# Altium schematic sheet SPECIAL_INPUT.SchDoc
size A4; SheetNumber: 9; SheetTotal: 15
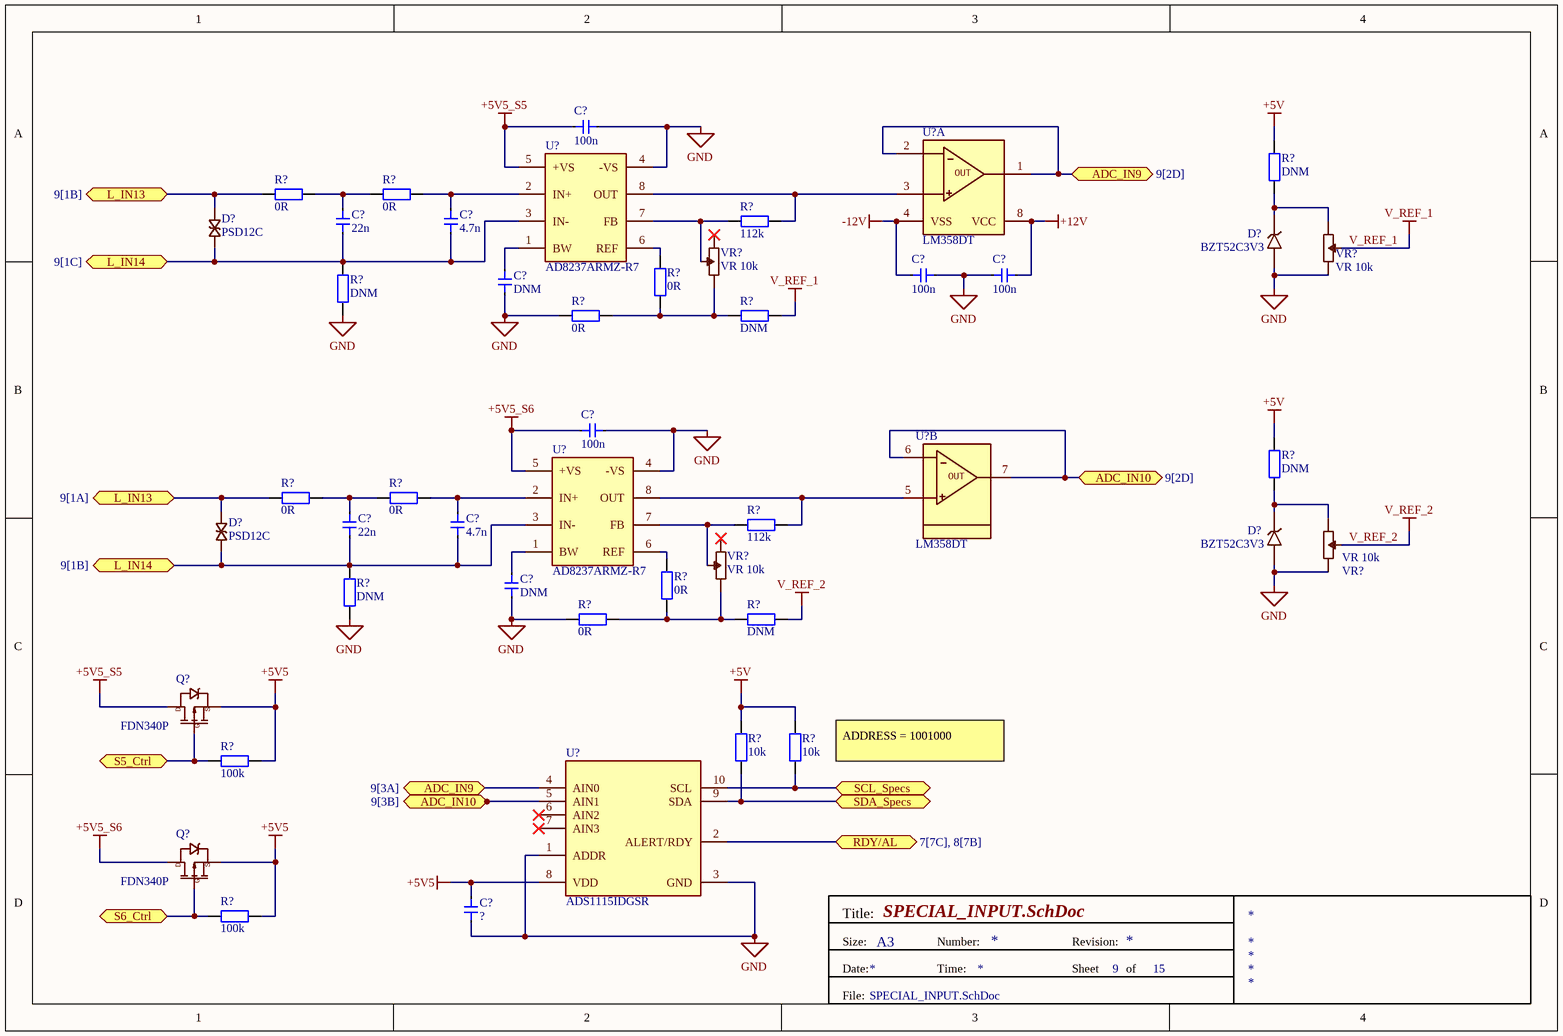
[diagram p0: SPECIAL_INPUT.SchDoc]

## Parts
(Parts that share a designator on the sheet are numbered #1, #2 ... from top to bottom, then left to right.)
C?#1  100n  [Cap 0603]
C?#2  22n  [Cap 0603]
C?#3  4.7n  [Cap 0603]
C?#4  100n  [Cap 0603]
C?#5  100n  [Cap 0603]
C?#6  DNM  [Cap 0603]
C?#7  100n  [Cap 0603]
C?#8  22n  [Cap 0603]
C?#9  4.7n  [Cap 0603]
C?#10  DNM  [Cap 0603]
C?#11  ?  [Cap 0603]
D?#1  PSD12C  [SOD-323]
D?#2  BZT52C3V3  [SOD-123F]
D?#3  PSD12C  [SOD-323]
D?#4  BZT52C3V3  [SOD-123F]
Q?#1  FDN340P  [FDN340P]
Q?#2  FDN340P  [FDN340P]
R?#1  DNM  [tro smd 0603]
R?#2  0R  [tro smd 0603]
R?#3  0R  [tro smd 0603]
R?#4  112k  [Tro smd 0603]
R?#5  0R  [tro smd 0603]
R?#6  DNM  [tro smd 0603]
R?#7  0R  [tro smd 0603]
R?#8  DNM  [tro smd 0603]
R?#9  DNM  [tro smd 0603]
R?#10  0R  [tro smd 0603]
R?#11  0R  [tro smd 0603]
R?#12  112k  [Tro smd 0603]
R?#13  0R  [tro smd 0603]
R?#14  DNM  [tro smd 0603]
R?#15  0R  [tro smd 0603]
R?#16  DNM  [tro smd 0603]
R?#17  10k  [tro smd 0603]
R?#18  10k  [tro smd 0603]
R?#19  100k  [tro smd 0603]
R?#20  100k  [tro smd 0603]
U?#1  LM358DT  [SOIC8]  (part A of 2)
U?#2  AD8237ARMZ-R7  [AD8237ARMZ-R7]
U?#3  LM358DT  [SOIC8]  (part B of 2)
U?#4  AD8237ARMZ-R7  [AD8237ARMZ-R7]
U?#5  ADS1115IDGSR  [AD8237ARMZ-R7]
VR?#1  VR 10k  [VR]
VR?#2  VR 10k  [VR]
VR?#3  VR 10k  [VR]
VR?#4  VR 10k  [VR]

## Ports
ADC_IN9 (bidir, see 9[2D]), ADC_IN9 (bidir, see 9[3A]), ADC_IN10 (bidir, see 9[2D]), ADC_IN10 (bidir, see 9[3B]), L_IN13 (bidir, see 9[1A]), L_IN13 (bidir, see 9[1B]), L_IN14 (bidir, see 9[1B]), L_IN14 (bidir, see 9[1C]), RDY/AL (bidir, see 7[7C], 8[7B]), S5_Ctrl (bidir), S6_Ctrl (bidir), SCL_Specs (bidir), SDA_Specs (bidir)

## Nets
+5V: R?#1.2 R?#9.2 R?#17.2 R?#18.2
+5V5: C?#11.2 Q?#1.2 Q?#2.2 R?#19.2 R?#20.2 U?#5.8(VDD)
+5V5_S5: C?#1.1 Q?#1.3 U?#2.5(+VS)
+5V5_S6: C?#7.1 Q?#2.3 U?#4.5(+VS)
+12V: C?#5.2 U?#1.8(VCC)
-12V: C?#4.1 U?#1.4(VSS)
GND: C?#1.2 C?#4.2 C?#5.1 C?#6.2 C?#7.2 C?#10.2 C?#11.1 D?#2.A D?#4.A R?#6.2 R?#7.2 R?#14.2 R?#15.2 U?#2.4(-VS) U?#4.4(-VS) U?#5.1(ADDR) U?#5.3(GND) VR?#1.3 VR?#3.3
V_REF_1: R?#8.1 VR?#1.2
V_REF_2: R?#16.1 VR?#3.2
ADC_IN9: U?#1.1 U?#1.2 U?#5.4(AIN0) ; port ADC_IN9
ADC_IN10: U?#3.6 U?#3.7 U?#5.5(AIN1) ; port ADC_IN10
L_IN13: D?#1.C D?#3.C R?#2.1 R?#10.1 ; port L_IN13
L_IN14: C?#2.2 C?#3.2 C?#8.2 C?#9.2 D?#1.A D?#3.A R?#6.1 R?#14.1 U?#2.3(IN-) U?#4.3(IN-) ; port L_IN14
RDY/AL: U?#5.2(ALERT/RDY) ; port RDY/AL
S5_Ctrl: Q?#1.1 R?#19.1 ; port S5_Ctrl
S6_Ctrl: Q?#2.1 R?#20.1 ; port S6_Ctrl
SCL_Specs: R?#18.1 U?#5.10(SCL) ; port SCL_Specs
SDA_Specs: R?#17.1 U?#5.9(SDA) ; port SDA_Specs
NetC?#2_1: C?#2.1 R?#2.2 R?#3.1
NetC?#3_1: C?#3.1 R?#3.2 U?#2.2(IN+)
NetC?#6_1: C?#6.1 U?#2.1(BW)
NetC?#8_1: C?#8.1 R?#10.2 R?#11.1
NetC?#9_1: C?#9.1 R?#11.2 U?#4.2(IN+)
NetC?#10_1: C?#10.1 U?#4.1(BW)
NetD?#2_K: D?#2.K R?#1.1 VR?#1.1
NetD?#4_K: D?#4.K R?#9.1 VR?#3.1
NetR?#4_1: R?#4.1 U?#2.7(FB) VR?#2.2
NetR?#4_2: R?#4.2 U?#1.3 U?#2.8(OUT)
NetR?#5_1: R?#5.1 U?#2.6(REF)
NetR?#5_2: R?#5.2 R?#7.1 R?#8.2 VR?#2.1
NetR?#12_1: R?#12.1 U?#4.7(FB) VR?#4.2
NetR?#12_2: R?#12.2 U?#3.5 U?#4.8(OUT)
NetR?#13_1: R?#13.1 U?#4.6(REF)
NetR?#13_2: R?#13.2 R?#15.1 R?#16.2 VR?#4.1

Not connected (* = marked no-connect by the designer): U?#5 6(AIN2)* 7(AIN3)*; VR?#2 3*; VR?#4 3*

## Notes on the sheet
- (near R?#18) ADDRESS = 1001000
- Title:
- Size:
- Date:
- A3
- Number:
- Time:
- Revision:
- Sheet
- of
- File:
- (in symbol FDN340P) D; S; G
- (in symbol LM358DT, part A) OUT
- (in symbol LM358DT, part B) OUT

## Library data of the parts
C?#1-C?#11 = Cap 0603: Capacitor SMD 0603
D?#1 D?#3 = PSD12C: Package SOD323, Diode TVS, 50 pF, 29.5 V
D?#2 D?#4 = BZT52C3V3: https://thegioiic.com/bzt52c3v3-diode-zener-3-3v-500mw
R?#1 R?#9 R?#17 R?#18 = Tro 0603 1% 10k: Dán; Don_Vi: Con; So_Chan: 2; Ten_Linh_Kien: Trở 0603 1% 10k; Ma_Hang: MH006333; Chung_Loai: Dán; Kieu_Chan: *
R?#2 R?#3 R?#5-R?#8 R?#10 R?#11 R?#13-R?#16 = Tro 0603 1% 0R: Dán; Don_Vi: Con; So_Chan: 2; Ten_Linh_Kien: Trở 0603 1% 0R; Ma_Hang: MH005792; Chung_Loai: Dán; Kieu_Chan: *
R?#4 R?#12 = Tro 0603 1% 33k: Dán; Don_Vi: Con; So_Chan: 2; Ten_Linh_Kien: Trở 0603 1% 33k; Ma_Hang: MH006335; Chung_Loai: Dán; Kieu_Chan: *
R?#19 R?#20 = Tro 0603 5% 100k: Dán; So_Chan: 2; Ten_Linh_Kien: Trở 0603 5% 100k; Ma_Hang: MH006314; Don_Vi: Con; Chung_Loai: Dán; Kieu_Chan: *
U?#1 U?#3 = LM358DT: Điện áp: 2V ~ 36V, ± 1V ~ 18V, Số chân: 8
U?#2 U?#4 = AD8237ARMZ-R7: Instrumentation Amplifier, 1 Func, 75uV Offset-Max, 0.2MHz Band Width, CMOS, PDSO8; Manufacturer: Analog Devices; Package Body Material: Plastic; Channels: 1; Package Equivalence Code: TSSOP8,.19; Power Supplies: 5V; Max Supply Current: 150uA; Qualification Status: Not Qualified; Supplier: Digikey; Supplier Part Number: AD8237ARMZ-R7CT-ND; Manufacturer Part Number: AD8237ARMZ-R7; RoHS: Yes; Category: Amplifiers - Op Amps, Buffer, Instrumentation; Stock: 5371; Pricing: 1=4.34, 10=2.871, 25=2.4888, 100=2.06, 250=1.8516, 500=1.72446 (USD); Case/Package: TSSOP; Pins: 8; Package Shape: Rectangular; Terminal Finish: Tin; Min Operating Temperature: -40°C; Max Operating Temperature: 125°C; JESD-609 Code: e3; Amplifier Type: INSTRUMENTATION AMPLIFIER; JESD-30 Code: R-PDSO-G8; Moisture Sensitivity Level: 1; Package Style: SMALL OUTLINE, THIN PROFILE, SHRINK PITCHMeter; Nominal Supply Voltage: 5V; Surface Mount: Yes; Technology: CMOS; Terminal Form: Gull Wing; Terminal Position: DUAL; Terminal Pitch: 0.635mm; Temperature Grade: AUTOMOTIVE; Reach SVHC Compliant: Yes; RoHS Compliant: Yes; ComponentLink1URL: https://datasheet.ciiva.com:443/pdfs/VipMasterIC/IC/ANDI/ANDIS13412/ANDIS13412-1.pdf?src-supplier=IHS+Markit; ComponentLink1Description: https://datasheet.ciiva.com:443/pdfs/VipMasterIC/IC/ANDI/ANDIS13412/ANDIS13412-1.pdf?src-supplier=IHS+Markit; ComponentLink2URL: https://datasheet.ciiva.com/6626/ad8237-6626733.pdf?src-supplier=Digikey; ComponentLink2Description: https://datasheet.ciiva.com/6626/ad8237-6626733.pdf?src-supplier=Digikey; ComponentLink3URL: https://datasheet.ciiva.com/8582/ad8237-8582303.pdf?src-supplier=Avnet; ComponentLink3Description: https://datasheet.ciiva.com/8582/ad8237-8582303.pdf?src-supplier=Avnet
U?#5 = ADS1115IDGSR: ADC, Delta-Sigma, 16-Bit, 1 Func, 4 Channel, Serial Access, PDSO10; Manufacturer: Texas Instruments; Package Body Material: Plastic; Max Input Voltage (AC): 4.096V; Min Input Voltage (AC): -4.096V; Conversion Time-Max: 1.162us; Linearity Error-Max (EL): 0.0015%; Number of Analog In Channels: 4; Number of Bits: 16; Channels: 1; Output Bit Code: 2''S COMPLEMENT BINARY; Package Equivalence Code: TSSOP10,.19,20; Power Supplies: 3.3V; Sample Rate (Hz): 860kHz; Qualification Status: Not Qualified; Supplier: Digikey; Supplier Part Number: 296-38849-1-ND; Manufacturer Part Number: ADS1115IDGSR; RoHS: Yes; Category: Analog to Digital Converters (ADCs); Stock: 3443; Pricing: 1=4.96, 10=3.644, 25=3.3144, 100=2.952, 250=2.77904, 500=2.67478, 1000=2.58892 (USD); Case/Package: TSSOP; Pins: 10; Package Shape: Square; Terminal Finish: Nickel; Min Operating Temperature: -40°C; Max Operating Temperature: 125°C; JESD-609 Code: e4; Output Format: Serial; Converter Type: DELTA-SIGMA; JESD-30 Code: S-PDSO-G10; Moisture Sensitivity Level: 2; Package Style: SMALL OUTLINE, THIN PROFILE, SHRINK PITCHMeter; Peak Reflow Temperature (Cel): 260°C; Nominal Supply Voltage: 3.3V; Surface Mount: Yes; Terminal Form: Gull Wing; Terminal Position: DUAL; Length: 3mm; Width: 3mm; Height - Seated (Max): 1.1mm; Terminal Pitch: 0.5mm; Temperature Grade: AUTOMOTIVE; Reach SVHC Compliant: Yes; RoHS Compliant: Yes; ComponentLink1URL: https://www.ti.com:443/lit/ds/symlink/ads1113.pdf?src-supplier=IHS+Markit; ComponentLink1Description: https://www.ti.com:443/lit/ds/symlink/ads1113.pdf?src-supplier=IHS+Markit; ComponentLink2URL: https://datasheet.ciiva.com/4031/47725463s8438921n7713-4031028.pdf?src-supplier=Arrow+Electronics; ComponentLink2Description: https://datasheet.ciiva.com/4031/47725463s8438921n7713-4031028.pdf?src-supplier=Arrow+Electronics
VR?#1-VR?#4 = EVM3E-103: 10K Ohm, 20%